# EAGLE design WiFly-BoosterPack-RevA1 (EAGLE 6.3)

## Sheet 1 of 2
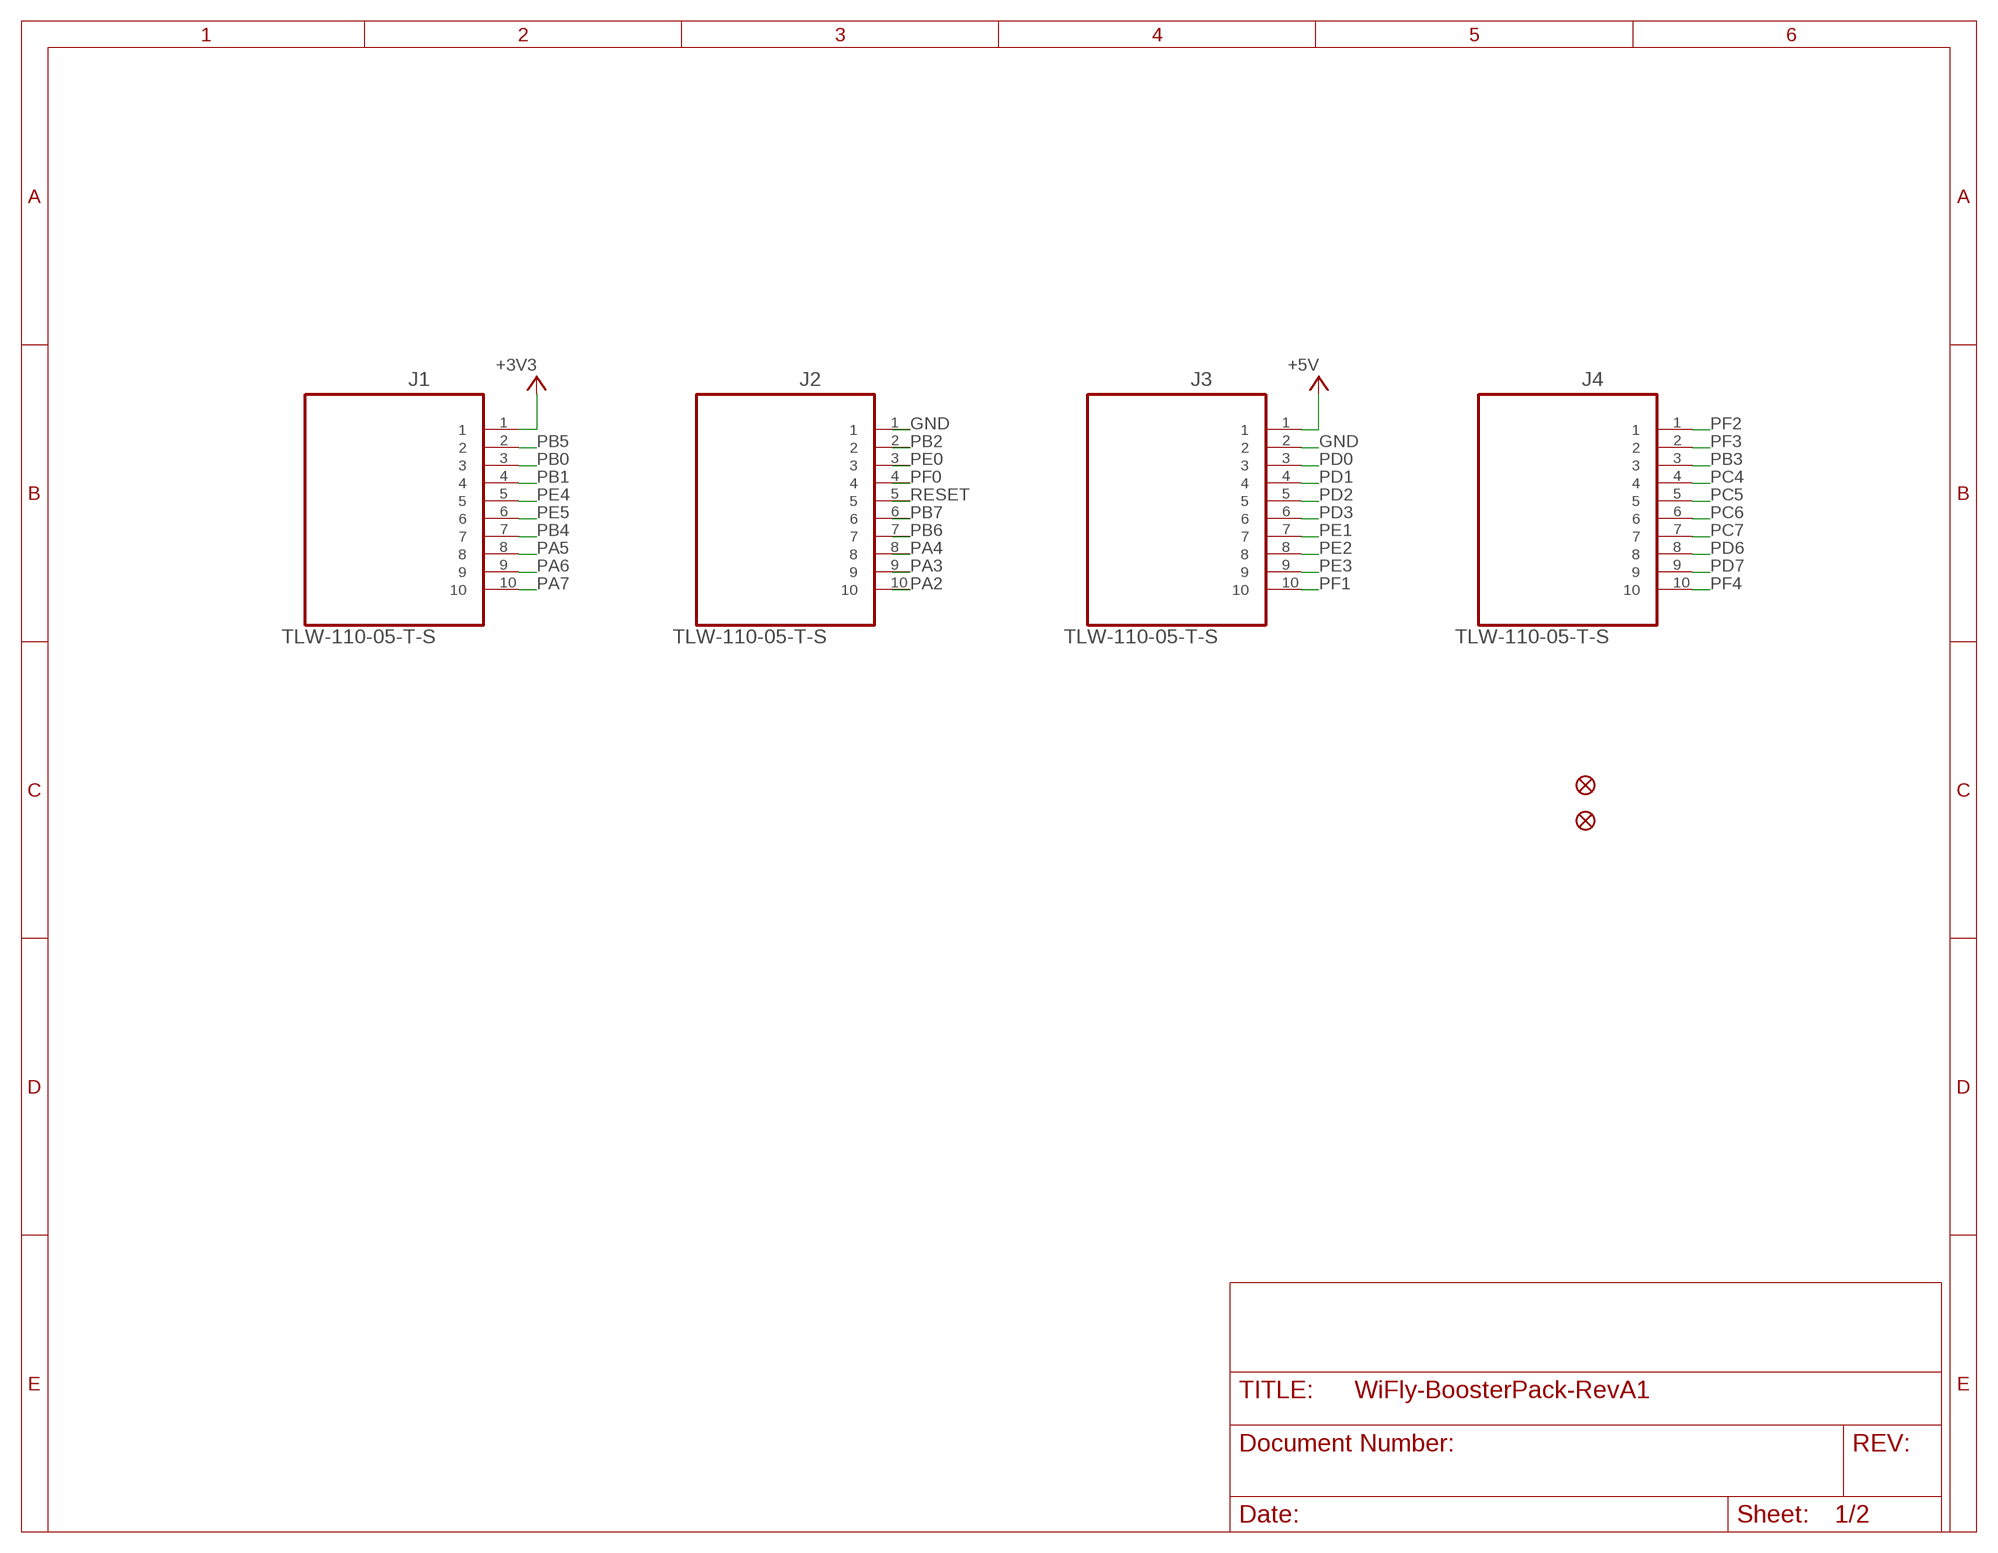
[diagram p0: schematic, sheet 1]

### Parts
FID1  FIDUCIAL1X2  [FIDUCIAL-1X2]
FID2  FIDUCIAL1X2  [FIDUCIAL-1X2]
J1  TLW-110-05-T-S  [SAMTEC_TLW-110-05-T-S]
J2  TLW-110-05-T-S  [SAMTEC_TLW-110-05-T-S]
J3  TLW-110-05-T-S  [SAMTEC_TLW-110-05-T-S]
J4  TLW-110-05-T-S  [SAMTEC_TLW-110-05-T-S]

### Nets
+3V3 [power]: J1.1 ; also sheet 2
+5V [power]: J3.1
GND: J2.1 J3.2 ; also sheet 2
PA2: J2.10
PA3: J2.9
PA4: J2.8
PA5: J1.8
PA6: J1.9
PA7: J1.10
PB0: J1.3 ; also sheet 2
PB1: J1.4 ; also sheet 2
PB2: J2.2
PB3: J4.3
PB4: J1.7
PB5: J1.2
PB6: J2.7
PB7: J2.6
PC4: J4.4 ; also sheet 2
PC5: J4.5 ; also sheet 2
PC6: J4.6
PC7: J4.7
PD0: J3.3
PD1: J3.4
PD2: J3.5
PD3: J3.6
PD6: J4.8
PD7: J4.9
PE0: J2.3
PE1: J3.7
PE2: J3.8
PE3: J3.9
PE4: J1.5
PE5: J1.6
PF0: J2.4
PF1: J3.10
PF2: J4.1
PF3: J4.2
PF4: J4.10
RESET: J2.5

## Sheet 2 of 2
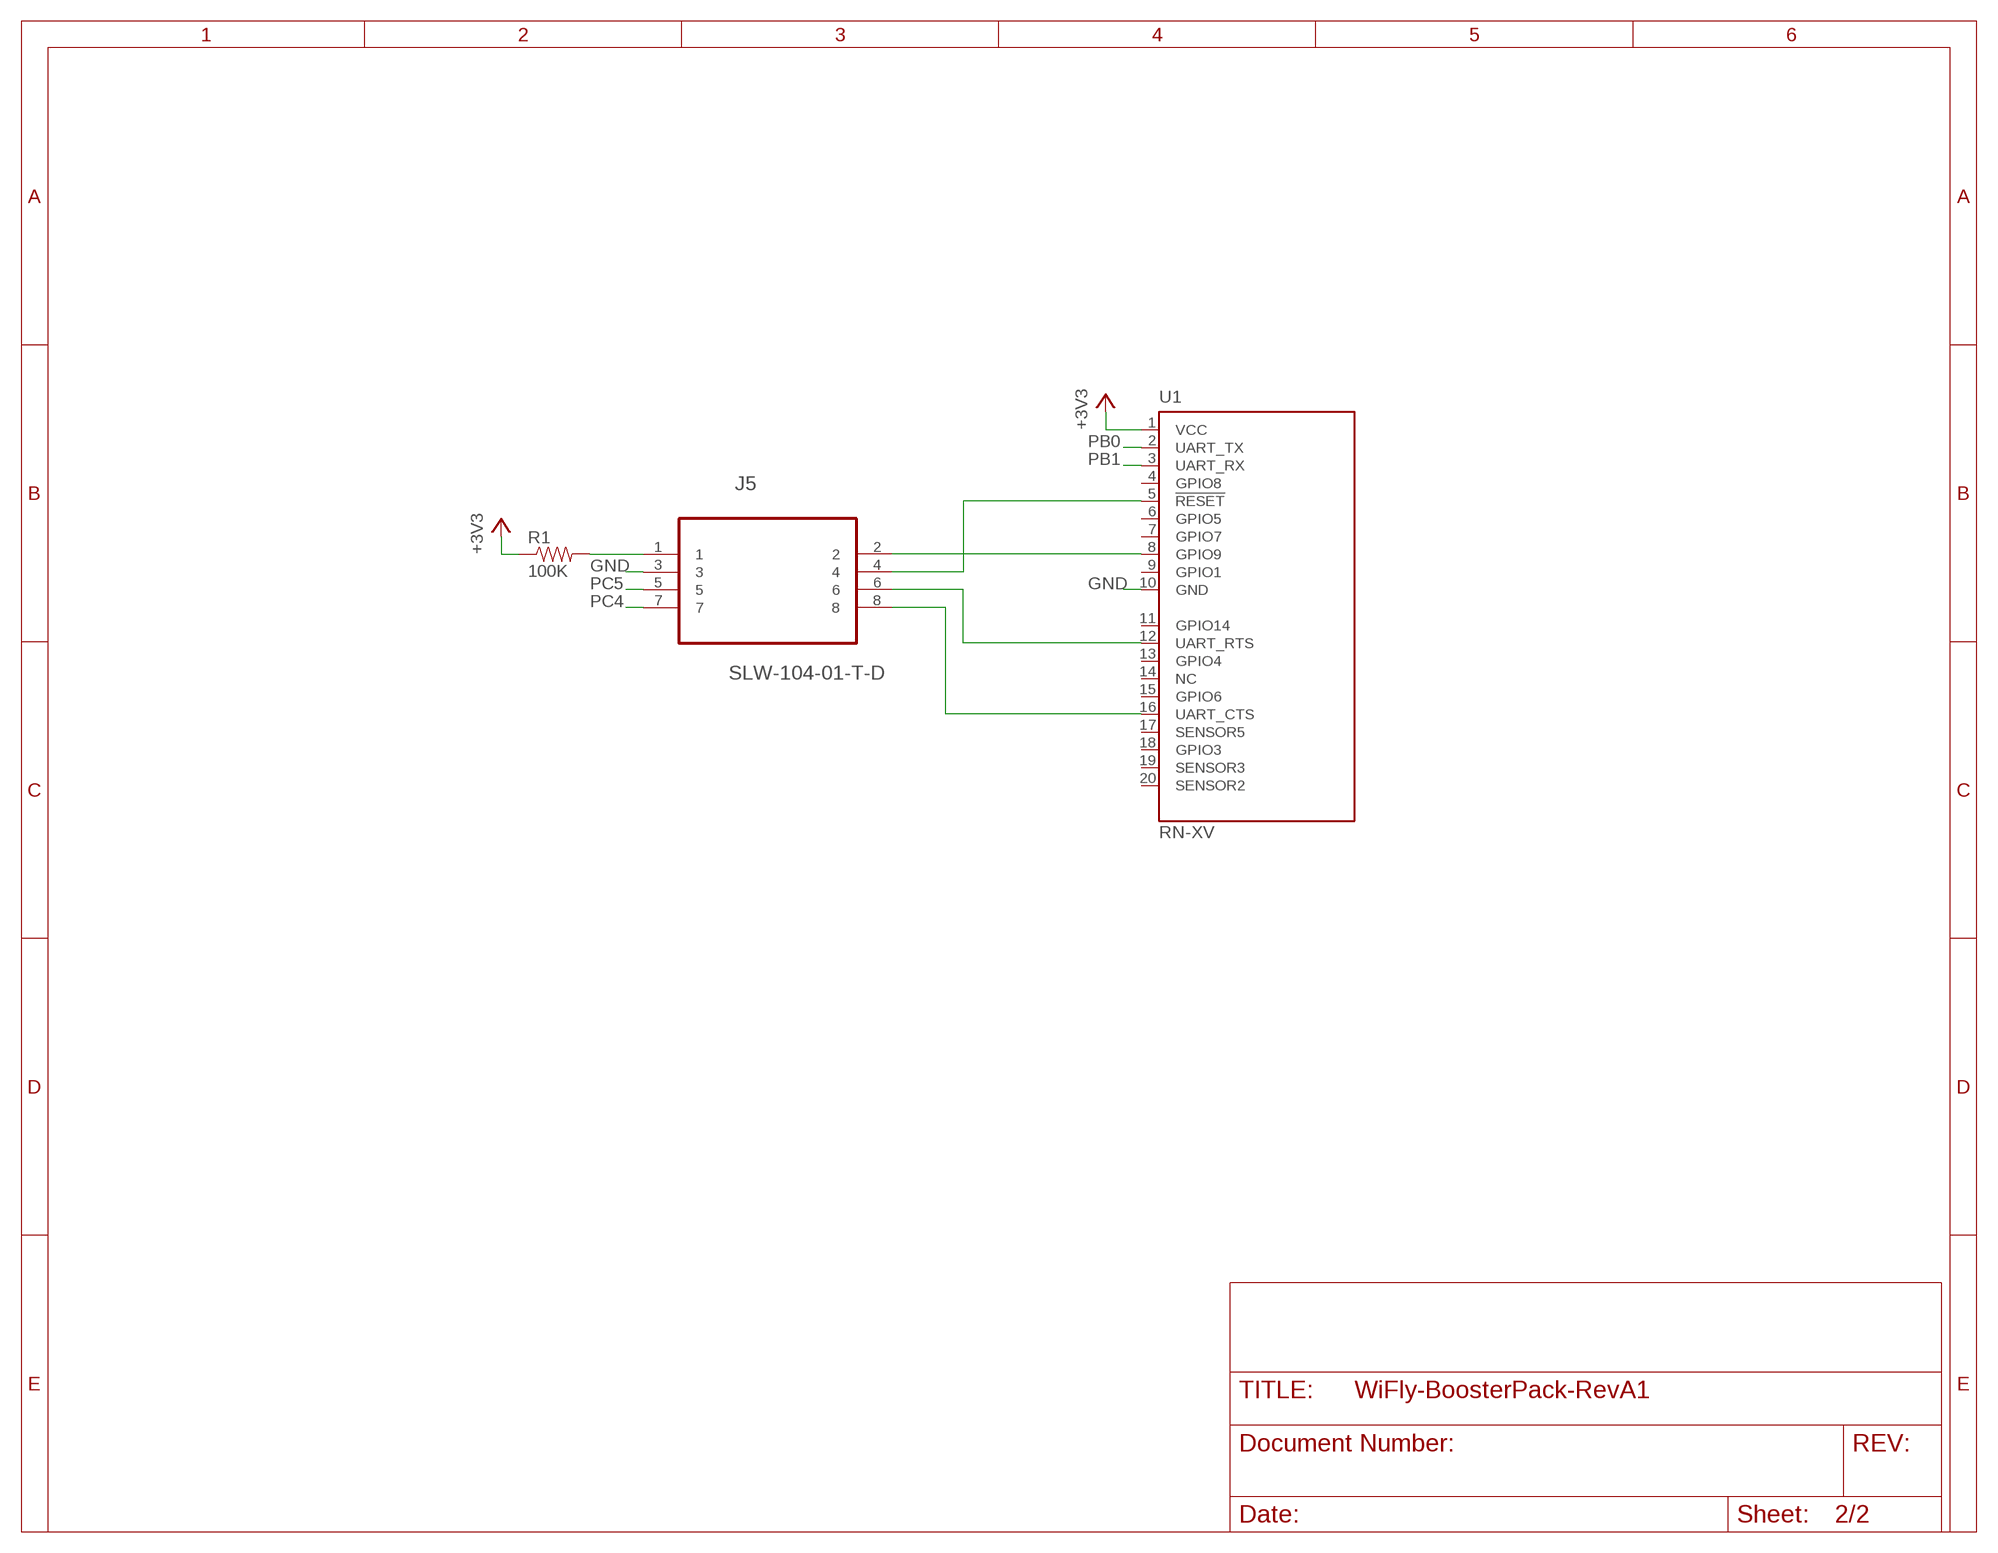
[diagram p1: schematic, sheet 2]

### Parts
J5  SLW-104-01-T-D  [SAMTEC_SLW-104-01-T-D]
R1  100K  RESISTORAXIAL-0.3  [AXIAL-0.3]
U1  RN-XV  [RN-VX]

### Nets
+3V3 [power]: R1.P$1 U1.1(VCC) ; also sheet 1
GND: J5.3 U1.10(GND) ; also sheet 1
N$1: J5.1 R1.P$2
N$2: J5.2 U1.8(GPIO9)
N$3: J5.4 U1.5(!RESET)
N$4: J5.6 U1.12(UART_RTS)
N$5: J5.8 U1.16(UART_CTS)
PB0: U1.2(UART_TX) ; also sheet 1
PB1: U1.3(UART_RX) ; also sheet 1
PC4: J5.7 ; also sheet 1
PC5: J5.5 ; also sheet 1
Unconnected: U1.4(GPIO8) U1.6(GPIO5) U1.7(GPIO7) U1.9(GPIO1) U1.11(GPIO14) U1.13(GPIO4) U1.14(NC) U1.15(GPIO6) U1.17(SENSOR5) U1.18(GPIO3) U1.19(SENSOR3) U1.20(SENSOR2)

## Library data of the parts
FID1 FID2 = SparkFun-Aesthetics:FIDUCIAL: Fiducial Alignment Points Various fiducial points for machine vision alignment.
J1-J4 = SAMTEC-Txx_By_element14_Batch_1:TLW-110-05-T-S: CONNECTOR HEADER, 10 WAY, 1ROW; MPN: TLW-110-05-T-S; OC_FARNELL: -; OC_NEWARK: 12P0439; PACKAGE: CONN HEADER 10 POS .100 inch; SUPPLIER: SAMTEC
J5 = SAMTEC-BBx-ERx-SLx-SDL_By_element14_Batch_1:SLW-104-01-T-D: LOW PROFILE SOCKET STRIPS, DOUBLE ROW, 8 WAY; MPN: SLW-104-01-T-D; OC_FARNELL: 1803515; OC_NEWARK: 11P6860; PACKAGE: LOW PROFILE SOCKET STRIPS, DOUBLE ROW, 8 WAY; SUPPLIER: SAMTEC
R1 = SparkFun-Resistors:RESISTOR: Resistor Basic schematic elements and footprints for 0603, 1206, and PTH resistors.
U1 = wifly:RN-XV: RN-XV Wifi module Source: Roving Networks, Inc. RN-VXData Sheet

## Net classes
1 power: width 0.381 mm

## Board
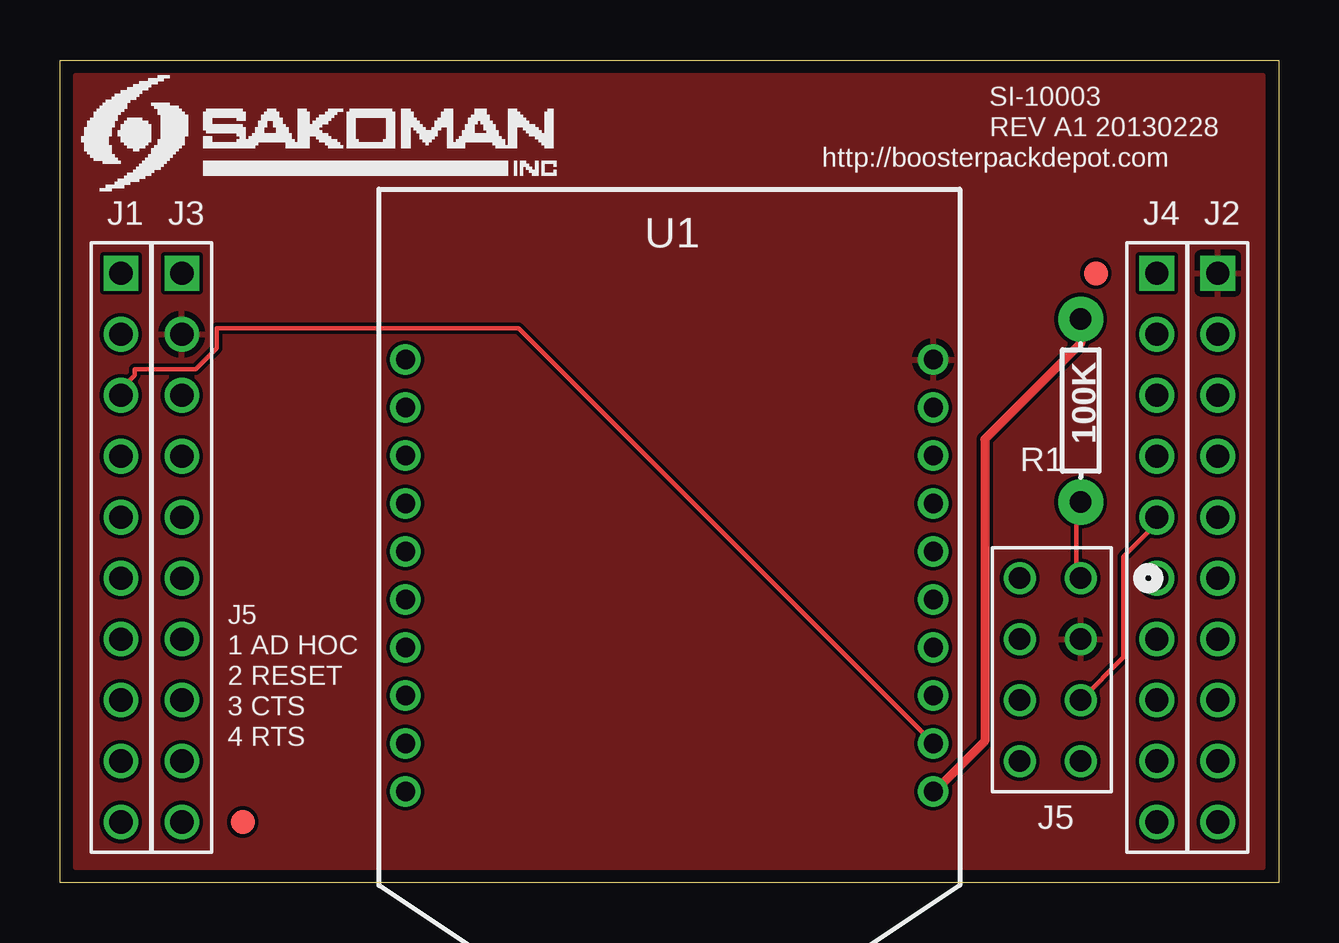
[diagram p2: board, top side]
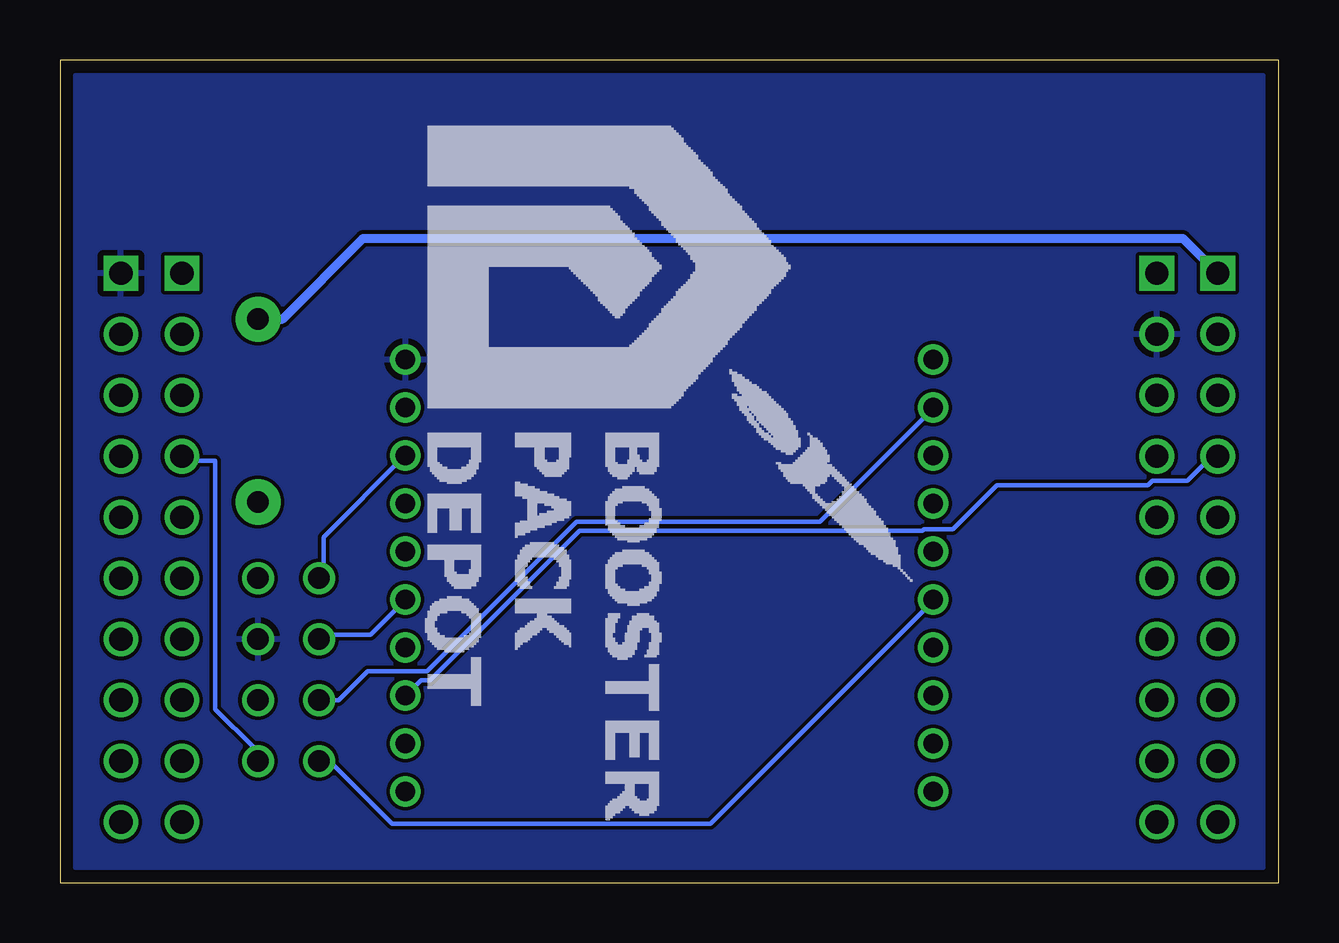
[diagram p3: board, bottom side, seen from below]

Size 50.8 x 34.29 mm. Coordinates in mm from the lower left corner, seen from the top.
Outline: 0,0 0,34.29 50.8,34.29 50.8,0 0,0
Copper layers (1*16): Top 0.0356mm / dielectric 1.5011mm / Bottom 0.0356mm
Design rules "LaenPCBOrder": minimum track width 6mil, minimum drill 13mil, track to track 6mil, track to pad 6mil, pad to pad 6mil, via to via 6mil, smd to smd 6mil, copper to edge 15mil, drill to drill 6mil, minimum pad ring 7mil, minimum via ring 7mil, stop-mask expansion 4mil, vias tented up to drill 0mil, thermal gap 10mil

### Footprints (pad centres in the part's own frame; a part is rotated, then mirrored left to right if it is on the bottom)
FIDUCIAL-1X2 = smd 1 x 1: 1 0,0
SAMTEC_TLW-110-05-T-S = drill 0.965 square: 1 -22.86,0 | drill 0.965: 2 -20.32,0; 3 -17.78,0; 4 -15.24,0; 5 -12.7,0; 6 -10.16,0; 7 -7.62,0; 8 -5.08,0; 9 -2.54,0; 10 0,0
SAMTEC_SLW-104-01-T-D = drill 0.889: 1 -7.62,2.54; 2 -7.62,0; 3 -5.08,2.54; 4 -5.08,0; 5 -2.54,2.54; 6 -2.54,0; 7 0,2.54; 8 0,0
AXIAL-0.3 = drill 0.9 pad 1.88: P$1 -3.81,0; P$2 3.81,0
RN-VX = drill 0.8 pad 1.27: 1 1.065,25.192; 2 1.065,23.192; 3 1.065,21.192; 4 1.065,19.192; 5 1.065,17.192; 6 1.065,15.193; 7 1.065,13.193; 8 1.065,11.193; 9 1.065,9.193; 10 1.065,7.192; 11 23.065,7.192; 12 23.065,9.193; 13 23.065,11.193; 14 23.065,13.193; 15 23.065,15.193; 16 23.065,17.192; 17 23.065,19.192; 18 23.065,21.192; 19 23.065,23.192; 20 23.065,25.192

### Placement (x,y rotation side)
FID1  7.62,2.54 0 top
FID2  43.18,25.4 0 top
J1  2.54,2.54 270 top
J2  48.26,2.54 270 top
J3  5.08,2.54 270 top
J4  45.72,2.54 270 top
J5  40.01,5.08 270 top
R1  42.55,19.68 270 top
U1  37.47,29 180 top

### Tracks (layer width: path | path; a pad name or v marks a point on that pad's centre or on a via)
+3V3
  Top 0.381: R1.P$1 42.55,22.48 38.54,18.48 38.54,5.91 36.45,3.81 U1.1
  Bottom 0.381: J1.1 4,26.86 38.16,26.86 41.53,23.5 R1.P$1
GND
  pour Bottom: 0.64,33.66 0.64,0.64 50.16,0.64 50.16,33.66
  pour Top: 0.64,33.66 0.64,0.64 50.16,0.64 50.16,33.66
N$1
  Top 0.178: J5.1 42.35,12.89 42.35,15.68 R1.P$2
N$2
  Bottom 0.178: J5.2 39.81,12.7 39.81,14.41 36.45,17.78 U1.8
N$3
  Bottom 0.178: J5.4 39.81,10.35 37.85,10.35 36.45,11.75 U1.5
N$4
  Bottom 0.178: J5.6 39.18,7.62 37.97,8.83 35.5,8.83 29.27,15.05 19.11,15.05 14.41,19.75 U1.12
N$5
  Bottom 0.178: J5.8 39.56,5.08 36.96,2.48 23.69,2.48 14.41,11.75 U1.16
PB0
  Top 0.178: J1.3 2.54,20.57 3.11,21.14 3.11,21.4 5.65,21.4 6.54,22.29 6.54,23.11 19.11,23.11 36.39,5.84 U1.2
PB1
  Bottom 0.178: J1.4 2.79,17.78 3.81,16.76 5.27,16.76 5.46,16.57 11.75,16.57 13.59,14.73 14.8,14.73 14.86,14.67 29.15,14.67 35.37,8.45 35.75,8.45 36.39,7.81 U1.3
PC4
  Bottom 0.178: J5.7 42.55,5.65 42.74,5.65 44.32,7.24 44.32,17.59 45.02,17.59 45.21,17.78 J4.4
PC5
  Top 0.178: J5.5 44.32,9.4 44.32,13.59 45.72,14.99 J4.5

### Text on the board
tPlace: SI-10003 | REV A1 20130228 | http://boosterpackdepot.com | J5 | 1 AD HOC | 2 RESET | 3 CTS | 4 RTS